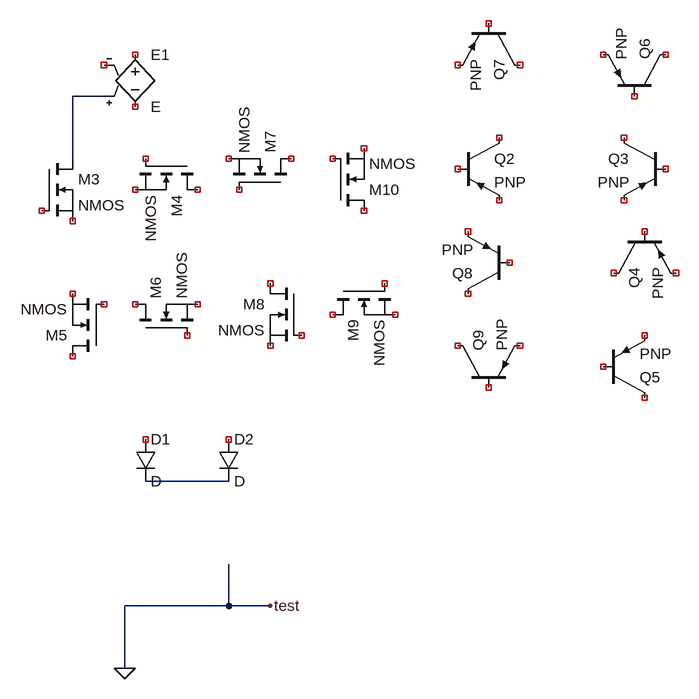
[diagram p0: schematic Draft.asc]
Draft.asc, the LTspice schematic file:
Version 4
SHEET 1 1304 680
WIRE -512 -800 -560 -800
WIRE -560 -704 -560 -800
WIRE -320 -208 -448 -208
WIRE -320 -16 -320 -80
WIRE -320 -16 -480 -16
WIRE -256 -16 -320 -16
WIRE -480 80 -480 -16
FLAG -480 80 0
FLAG -256 -16 test
SYMBOL nmos -608 -704 R0
SYMATTR InstName M3
SYMBOL nmos -368 -704 R90
SYMATTR InstName M4
SYMBOL nmos -512 -400 R180
SYMATTR InstName M5
SYMBOL nmos -464 -432 R270
SYMATTR InstName M6
SYMBOL nmos -224 -656 M270
SYMATTR InstName M7
SYMBOL nmos -208 -512 M0
SYMATTR InstName M8
SYMBOL nmos -160 -512 M90
SYMATTR InstName M9
SYMBOL nmos -160 -624 M180
SYMATTR InstName M10
SYMBOL pnp 32 -736 R0
SYMATTR InstName Q2
SYMBOL pnp 352 -736 M0
SYMATTR InstName Q3
SYMBOL pnp 272 -592 M90
SYMATTR InstName Q4
SYMBOL pnp 256 -336 M180
SYMATTR InstName Q5
SYMBOL pnp 352 -800 M270
SYMATTR InstName Q6
SYMBOL pnp 128 -912 R90
SYMATTR InstName Q7
SYMBOL pnp 112 -496 R180
SYMATTR InstName Q8
SYMBOL pnp 32 -352 R270
SYMATTR InstName Q9
SYMBOL e2 -464 -880 R0
SYMATTR InstName E1
SYMBOL diode -464 -272 R0
SYMATTR InstName D1
SYMBOL diode -336 -272 R0
SYMATTR InstName D2

The netlist it stands for:
* Draft.asc
M3 N001 NC_01 NC_02 NC_02 NMOS
M4 NC_03 NC_04 NC_05 NC_05 NMOS
M5 NC_06 NC_07 NC_08 NC_08 NMOS
M6 NC_09 NC_10 NC_11 NC_11 NMOS
M7 NC_12 NC_13 NC_14 NC_14 NMOS
M8 NC_15 NC_16 NC_17 NC_17 NMOS
M9 NC_18 NC_19 NC_20 NC_20 NMOS
M10 NC_21 NC_22 NC_23 NC_23 NMOS
Q2 NC_24 NC_25 NC_26 0 PNP
Q3 NC_27 NC_28 NC_29 0 PNP
Q4 NC_30 NC_31 NC_32 0 PNP
Q5 NC_33 NC_34 NC_35 0 PNP
Q6 NC_36 NC_37 NC_38 0 PNP
Q7 NC_39 NC_40 NC_41 0 PNP
Q8 NC_42 NC_43 NC_44 0 PNP
Q9 NC_45 NC_46 NC_47 0 PNP
E1 NC_48 NC_49 N001 NC_50 E
D1 NC_51 N002 D
D2 NC_52 N002 D
.model D D
.lib standard.dio
.model NPN NPN
.model PNP PNP
.lib standard.bjt
.model NMOS NMOS
.model PMOS PMOS
.lib standard.mos
.backanno
.end